# Altium schematic sheet MEA_CLDP.SchDoc
size A1
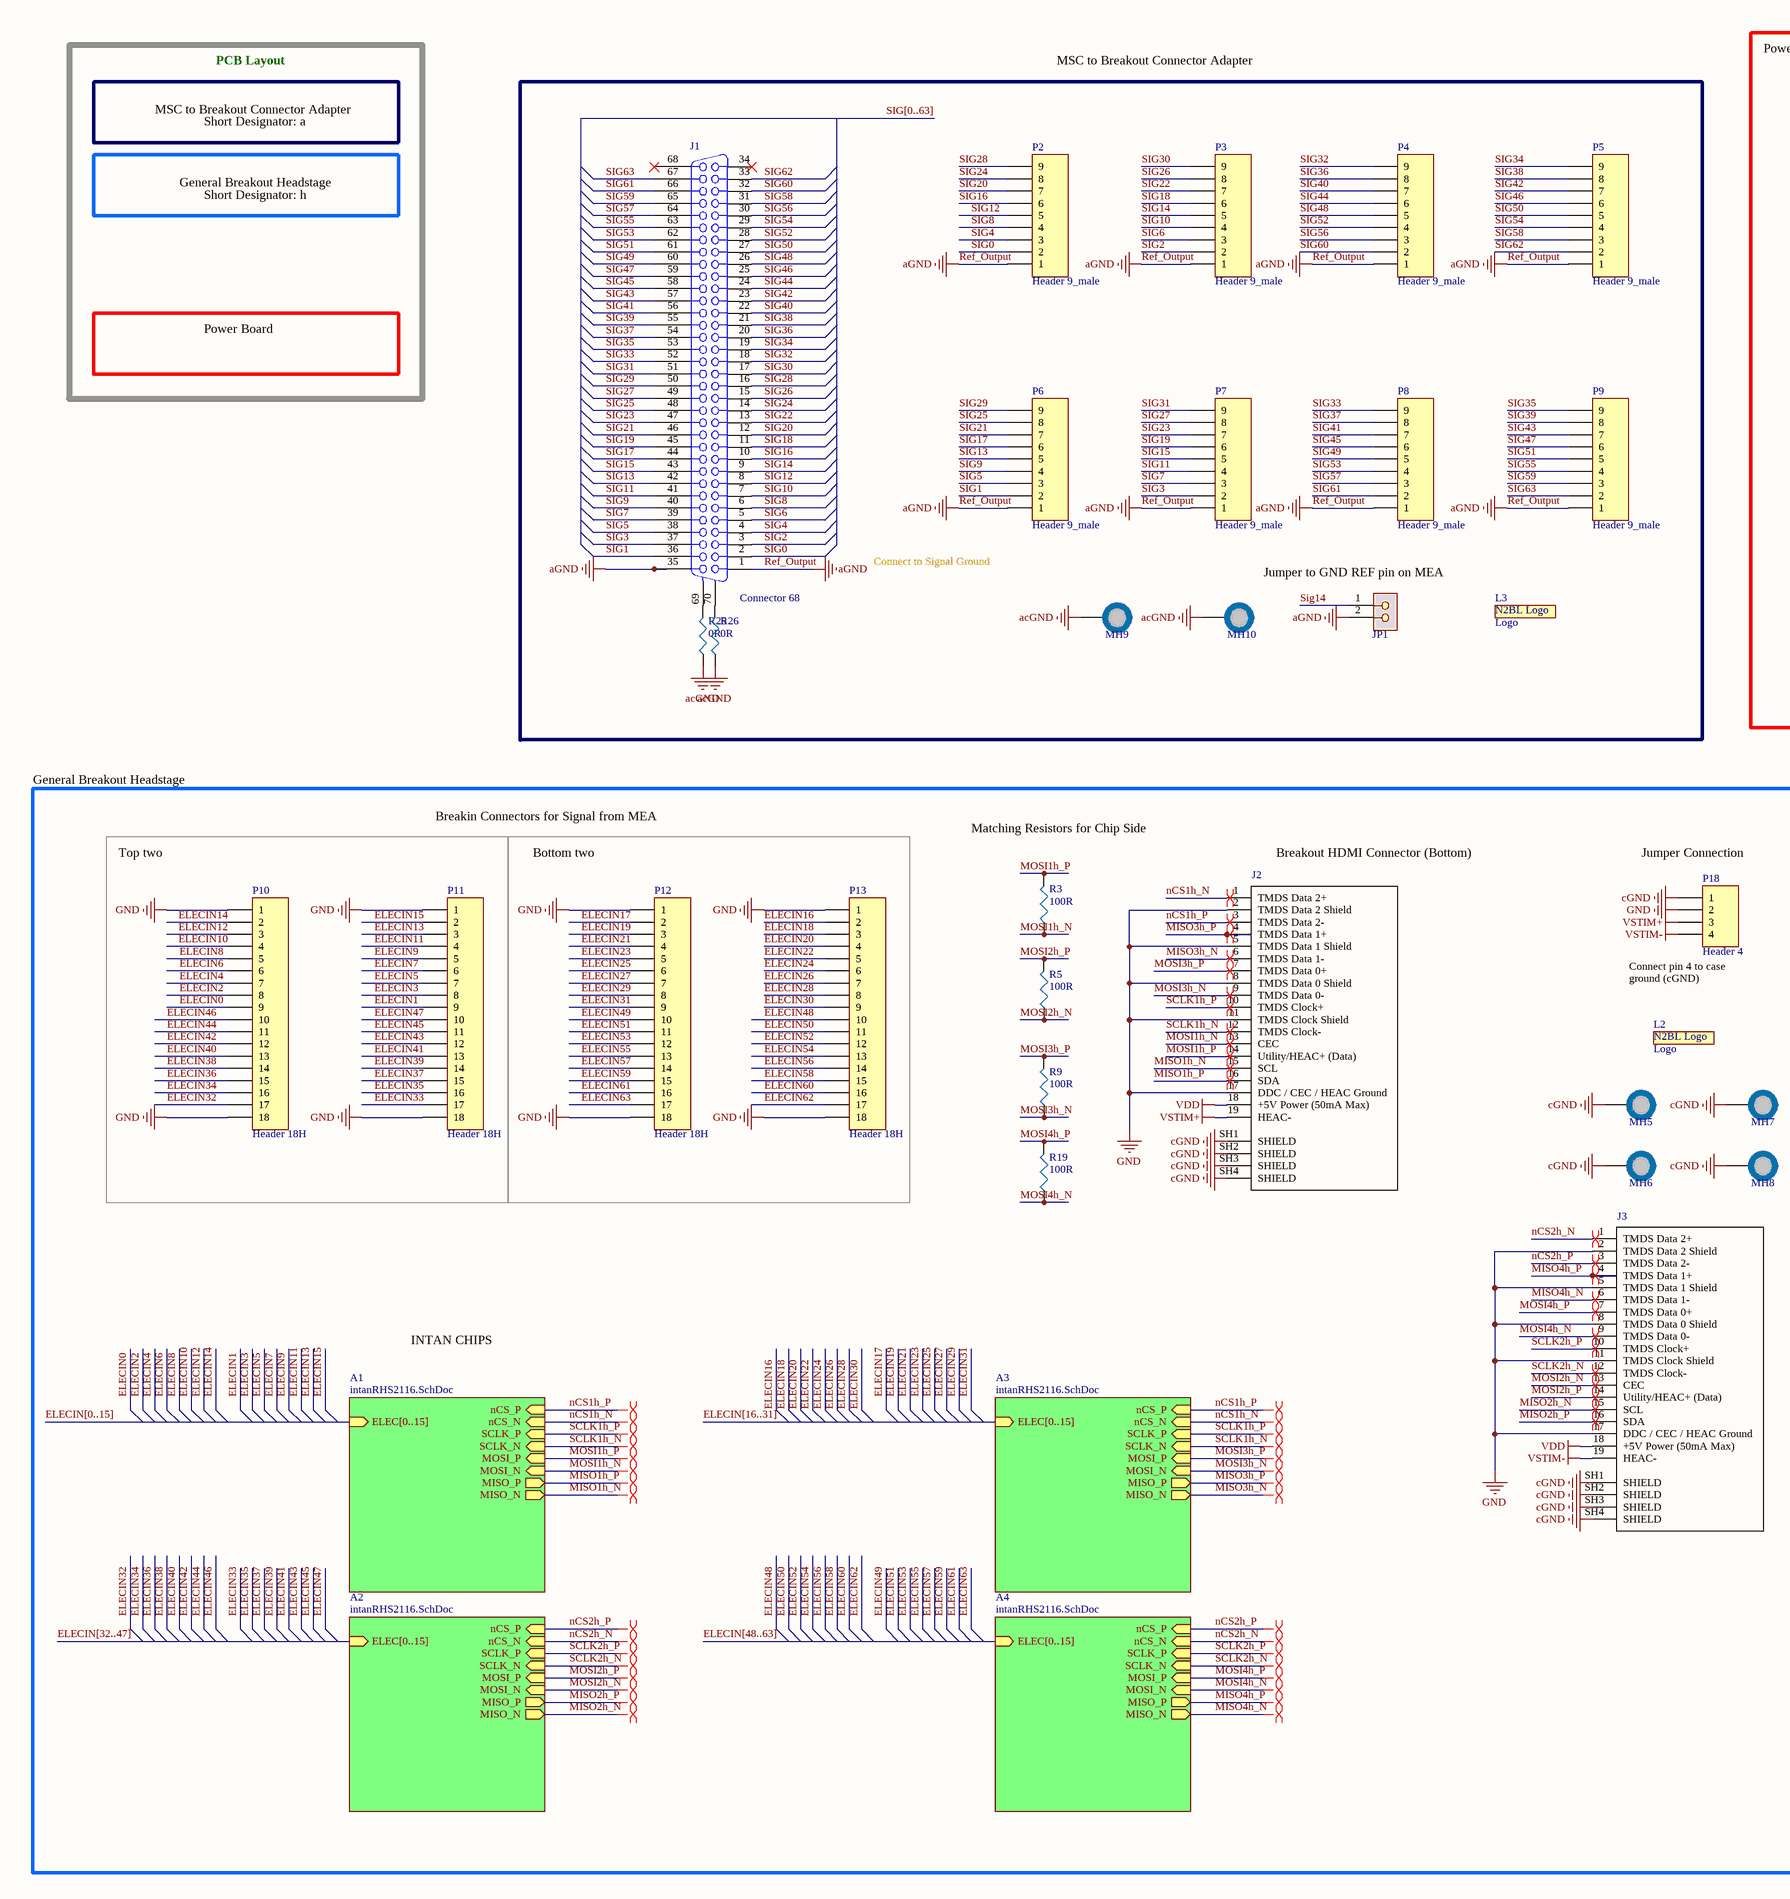
[diagram p0: MEA_CLDP.SchDoc, left]
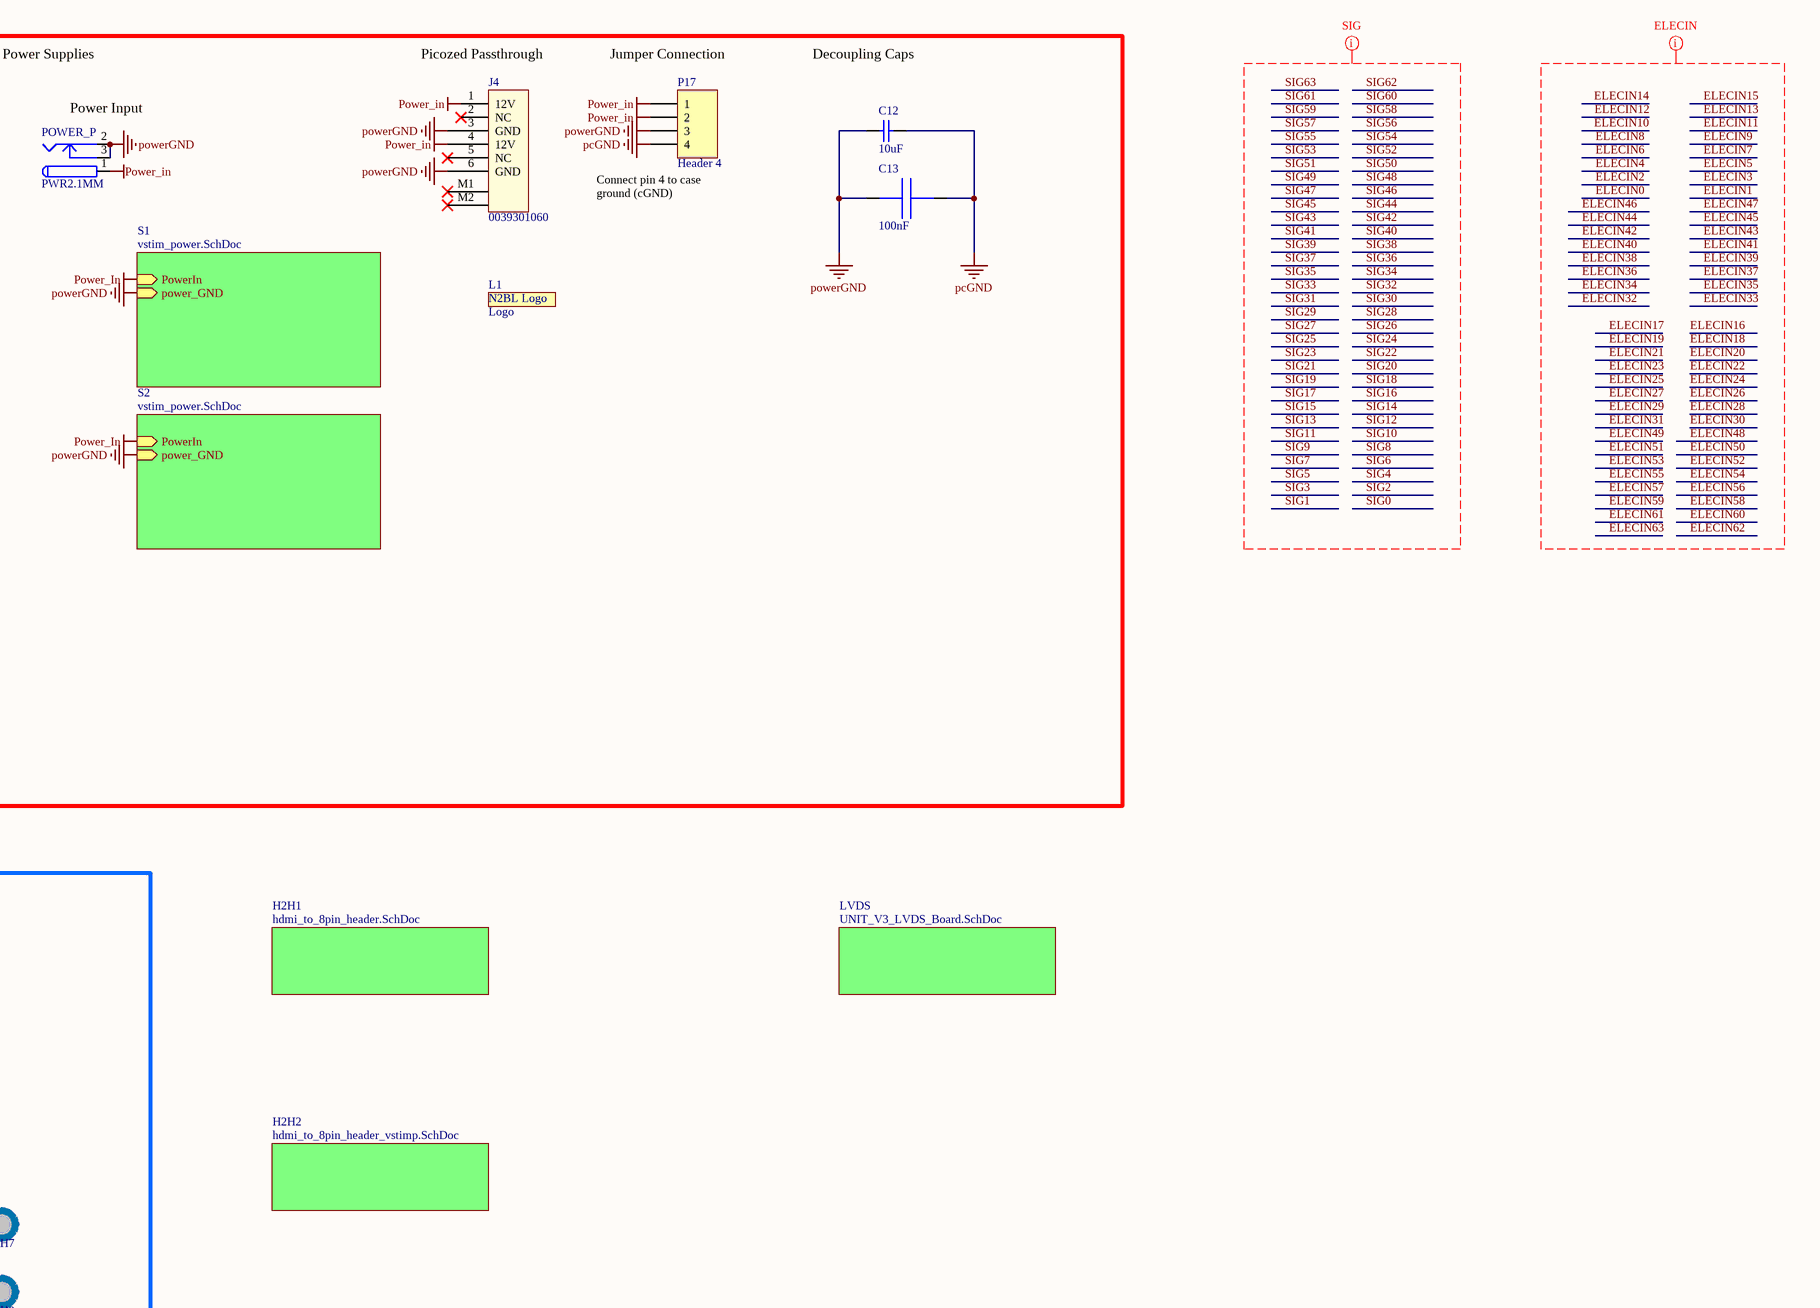
[diagram p1: MEA_CLDP.SchDoc, right]

## Parts
C12  10uF  [C0805]
C13  value 100nF  [rcl_0402i_1005m_most]  (hidden comment: capacitor_npol_ame)
J1  Connector 68  [CONN_2-5174339-5_2-5174339-5(Primary)]
J2  1747981-2  [TE_1747981-2_1747981-2(Primary)]  (value not drawn)
J3  1747981-2  [TE_1747981-2_1747981-2(Primary)]  (value not drawn)
J4  0039301060  [0039301060]
JP1  01x02  [HDR1X2]  (value not drawn)
L1  Logo  [N2BL_LOGO]
L2  Logo  [N2BL_LOGO]
L3  Logo  [N2BL_LOGO]
MH5  MH_7.4MMC_3.2MMD  [MH_7.4MMD_3.2MMD]  (value not drawn)  (no BOM)
MH6  MH_7.4MMC_3.2MMD  [MH_7.4MMD_3.2MMD]  (value not drawn)  (no BOM)
MH7  MH_7.4MMC_3.2MMD  [MH_7.4MMD_3.2MMD]  (value not drawn)  (no BOM)
MH8  MH_7.4MMC_3.2MMD  [MH_7.4MMD_3.2MMD]  (value not drawn)  (no BOM)
MH9  MH_7.4MMC_3.2MMD  [MH_7.4MMD_3.2MMD]  (value not drawn)  (no BOM)
MH10  MH_7.4MMC_3.2MMD  [MH_7.4MMD_3.2MMD]  (value not drawn)  (no BOM)
P2  Header 9_male  [TE_3-644456-9]
P3  Header 9_male  [TE_3-644456-9]
P4  Header 9_male  [TE_3-644456-9]
P5  Header 9_male  [TE_3-644456-9]
P6  Header 9_male  [TE_3-644456-9]
P7  Header 9_male  [TE_3-644456-9]
P8  Header 9_male  [TE_3-644456-9]
P9  Header 9_male  [TE_3-644456-9]
P10  Header 18H  [PPPC181LFBN-RC]
P11  Header 18H  [PPPC181LFBN-RC]
P12  Header 18H  [PPPC181LFBN-RC]
P13  Header 18H  [PPPC181LFBN-RC]
P17  Header 4  [OSTVN04A150]
P18  Header 4  [OSTVN04A150]
POWER_P  PWR2.1MM  [POWER2.1MM]
R3  100R  [rcl_0402i_1005m_most]
R5  100R  [rcl_0402i_1005m_most]
R9  100R  [rcl_0402i_1005m_most]
R19  100R  [rcl_0402i_1005m_most]
R25  0R  [rcl_0402i_1005m_most]
R26  0R  [rcl_0402i_1005m_most]

## Blocks framed on the sheet
Bottom two: P12 P13

## Sub-sheets
A1 = intanRHS2116.SchDoc: ELEC[0..15] (in), nCS_P (in), nCS_N (in), SCLK_P (in), SCLK_N (in), MOSI_P (in), MOSI_N (in), MISO_P (out), MISO_N (out)
A2 = intanRHS2116.SchDoc: ELEC[0..15] (in), nCS_P (in), nCS_N (in), SCLK_P (in), SCLK_N (in), MOSI_P (in), MOSI_N (in), MISO_P (out), MISO_N (out)
A3 = intanRHS2116.SchDoc: ELEC[0..15] (in), nCS_P (in), nCS_N (in), SCLK_P (in), SCLK_N (in), MOSI_P (in), MOSI_N (in), MISO_P (out), MISO_N (out)
A4 = intanRHS2116.SchDoc: ELEC[0..15] (in), nCS_P (in), nCS_N (in), SCLK_P (in), SCLK_N (in), MOSI_P (in), MOSI_N (in), MISO_P (out), MISO_N (out)
H2H1 = hdmi_to_8pin_header.SchDoc: no entries
H2H2 = hdmi_to_8pin_header_vstimp.SchDoc: no entries
LVDS = UNIT_V3_LVDS_Board.SchDoc: no entries
S1 = vstim_power.SchDoc: PowerIn (in), power_GND (in)
S2 = vstim_power.SchDoc: PowerIn (in), power_GND (in)

## Nets
acGND: MH9.1 MH10.1 R25.1 R26.1
cGND: J2.SH1(SHIELD) J2.SH2(SHIELD) J2.SH3(SHIELD) J2.SH4(SHIELD) J3.SH1(SHIELD) J3.SH2(SHIELD) J3.SH3(SHIELD) J3.SH4(SHIELD) MH5.1 MH6.1 MH7.1 MH8.1 P18.1
GND: J2.2(TMDS_Data_2_Shield) J2.5(TMDS_Data_1_Shield) J2.8(TMDS_Data_0_Shield) J2.11(TMDS_Clock_Shield) J2.17(DDC_/_CEC_/_HEAC_Ground) J3.2(TMDS_Data_2_Shield) J3.5(TMDS_Data_1_Shield) J3.8(TMDS_Data_0_Shield) J3.11(TMDS_Clock_Shield) J3.17(DDC_/_CEC_/_HEAC_Ground) P10.1 P10.18 P11.1 P11.18 P12.1 P12.18 P13.1 P13.18 P18.2
pcGND: C12.1 C13.1 P17.4
Power_In: J4.1(12V) J4.4(12V) P17.1 P17.2 POWER_P.1 ; sheet S1/PowerIn, sheet S2/PowerIn
powerGND: C12.2 C13.2 J4.3(GND) J4.6(GND) P17.3 POWER_P.2 POWER_P.3 ; sheet S1/power_GND, sheet S2/power_GND
Ref_Output: J1.1 J1.35 JP1.2 P2.1 P3.1 P4.1 P5.1 P6.1 P7.1 P8.1 P9.1  [also labelled aGND]
VDD: J2.18(+5V_Power_(50mA_Max)) J3.18(+5V_Power_(50mA_Max))
VSTIM+: J2.19(HEAC-) P18.3
VSTIM-: J3.19(HEAC-) P18.4
ELECIN0: P10.9
ELECIN1: P11.9
ELECIN2: P10.8
ELECIN3: P11.8
ELECIN4: P10.7
ELECIN5: P11.7
ELECIN6: P10.6
ELECIN7: P11.6
ELECIN8: P10.5
ELECIN9: P11.5
ELECIN10: P10.4
ELECIN11: P11.4
ELECIN12: P10.3
ELECIN13: P11.3
ELECIN14: P10.2
ELECIN15: P11.2
ELECIN16: P13.2
ELECIN17: P12.2
ELECIN18: P13.3
ELECIN19: P12.3
ELECIN20: P13.4
ELECIN21: P12.4
ELECIN22: P13.5
ELECIN23: P12.5
ELECIN24: P13.6
ELECIN25: P12.6
ELECIN26: P13.7
ELECIN27: P12.7
ELECIN28: P13.8
ELECIN29: P12.8
ELECIN30: P13.9
ELECIN31: P12.9
ELECIN32: P10.17
ELECIN33: P11.17
ELECIN34: P10.16
ELECIN35: P11.16
ELECIN36: P10.15
ELECIN37: P11.15
ELECIN38: P10.14
ELECIN39: P11.14
ELECIN40: P10.13
ELECIN41: P11.13
ELECIN42: P10.12
ELECIN43: P11.12
ELECIN44: P10.11
ELECIN45: P11.11
ELECIN46: P10.10
ELECIN47: P11.10
ELECIN48: P13.10
ELECIN49: P12.10
ELECIN50: P13.11
ELECIN51: P12.11
ELECIN52: P13.12
ELECIN53: P12.12
ELECIN54: P13.13
ELECIN55: P12.13
ELECIN56: P13.14
ELECIN57: P12.14
ELECIN58: P13.15
ELECIN59: P12.15
ELECIN60: P13.16
ELECIN61: P12.16
ELECIN62: P13.17
ELECIN63: P12.17
MISO1h_N: J2.15(SCL) ; sheet A1/MISO_N
MISO1h_P: J2.16(SDA) ; sheet A1/MISO_P
MISO2h_N: J3.15(SCL) ; sheet A2/MISO_N
MISO2h_P: J3.16(SDA) ; sheet A2/MISO_P
MISO3h_N: J2.6(TMDS_Data_1-) ; sheet A3/MISO_N
MISO3h_P: J2.4(TMDS_Data_1+) ; sheet A3/MISO_P
MISO4h_N: J3.6(TMDS_Data_1-) ; sheet A4/MISO_N
MISO4h_P: J3.4(TMDS_Data_1+) ; sheet A4/MISO_P
MOSI1h_N: J2.13(CEC) R3.1 ; sheet A1/MOSI_N
MOSI1h_P: J2.14(Utility/HEAC+_(Data)) R3.2 ; sheet A1/MOSI_P
MOSI2h_N: J3.13(CEC) R5.1 ; sheet A2/MOSI_N
MOSI2h_P: J3.14(Utility/HEAC+_(Data)) R5.2 ; sheet A2/MOSI_P
MOSI3h_N: J2.9(TMDS_Data_0-) R9.1 ; sheet A3/MOSI_N
MOSI3h_P: J2.7(TMDS_Data_0+) R9.2 ; sheet A3/MOSI_P
MOSI4h_N: J3.9(TMDS_Data_0-) R19.1 ; sheet A4/MOSI_N
MOSI4h_P: J3.7(TMDS_Data_0+) R19.2 ; sheet A4/MOSI_P
nCS1h_N: J2.1(TMDS_Data_2+) ; sheet A1/nCS_N, sheet A3/nCS_N
nCS1h_P: J2.3(TMDS_Data_2-) ; sheet A1/nCS_P, sheet A3/nCS_P
nCS2h_N: J3.1(TMDS_Data_2+) ; sheet A2/nCS_N, sheet A4/nCS_N
nCS2h_P: J3.3(TMDS_Data_2-) ; sheet A2/nCS_P, sheet A4/nCS_P
SCLK1h_N: J2.12(TMDS_Clock-) ; sheet A1/SCLK_N, sheet A3/SCLK_N
SCLK1h_P: J2.10(TMDS_Clock+) ; sheet A1/SCLK_P, sheet A3/SCLK_P
SCLK2h_N: J3.12(TMDS_Clock-) ; sheet A2/SCLK_N, sheet A4/SCLK_N
SCLK2h_P: J3.10(TMDS_Clock+) ; sheet A2/SCLK_P, sheet A4/SCLK_P
SIG0: J1.2 P2.2
SIG1: J1.36 P6.2
SIG2: J1.3 P3.2
SIG3: J1.37 P7.2
SIG4: J1.4 P2.3
SIG5: J1.38 P6.3
SIG6: J1.5 P3.3
SIG7: J1.39 P7.3
SIG8: J1.6 P2.4
SIG9: J1.40 P6.4
SIG10: J1.7 P3.4
SIG11: J1.41 P7.4
SIG12: J1.8 P2.5
SIG13: J1.42 P6.5
SIG14: J1.9 JP1.1 P3.5
SIG15: J1.43 P7.5
SIG16: J1.10 P2.6
SIG17: J1.44 P6.6
SIG18: J1.11 P3.6
SIG19: J1.45 P7.6
SIG20: J1.12 P2.7
SIG21: J1.46 P6.7
SIG22: J1.13 P3.7
SIG23: J1.47 P7.7
SIG24: J1.14 P2.8
SIG25: J1.48 P6.8
SIG26: J1.15 P3.8
SIG27: J1.49 P7.8
SIG28: J1.16 P2.9
SIG29: J1.50 P6.9
SIG30: J1.17 P3.9
SIG31: J1.51 P7.9
SIG32: J1.18 P4.9
SIG33: J1.52 P8.9
SIG34: J1.19 P5.9
SIG35: J1.53 P9.9
SIG36: J1.20 P4.8
SIG37: J1.54 P8.8
SIG38: J1.21 P5.8
SIG39: J1.55 P9.8
SIG40: J1.22 P4.7
SIG41: J1.56 P8.7
SIG42: J1.23 P5.7
SIG43: J1.57 P9.7
SIG44: J1.24 P4.6
SIG45: J1.58 P8.6
SIG46: J1.25 P5.6
SIG47: J1.59 P9.6
SIG48: J1.26 P4.5
SIG49: J1.60 P8.5
SIG50: J1.27 P5.5
SIG51: J1.61 P9.5
SIG52: J1.28 P4.4
SIG53: J1.62 P8.4
SIG54: J1.29 P5.4
SIG55: J1.63 P9.4
SIG56: J1.30 P4.3
SIG57: J1.64 P8.3
SIG58: J1.31 P5.3
SIG59: J1.65 P9.3
SIG60: J1.32 P4.2
SIG61: J1.66 P8.2
SIG62: J1.33 P5.2
SIG63: J1.67 P9.2
NetJ1_69: J1.69(MH1) R25.2
NetJ1_70: J1.70(MH2) R26.2

Not connected (* = marked no-connect by the designer): J1 34* 68*; J4 2(NC)* 5(NC)* M1* M2*

## Buses and harness runs
bus ELECIN[0..15] = sheet A1/ELEC[0..15]
bus ELECIN[16..31] = sheet A3/ELEC[0..15]
bus ELECIN[32..47] = sheet A2/ELEC[0..15]
bus ELECIN[48..63] = sheet A4/ELEC[0..15]
bus SIG[0..63]

## Layout directives
differential pair: MISO1h_N, MISO1h_P, MISO2h_N, MISO2h_P, MISO3h_N, MISO3h_P, MISO4h_N, MISO4h_P, MOSI1h_N, MOSI1h_P, MOSI2h_N, MOSI2h_P, MOSI3h_N, MOSI3h_P, MOSI4h_N, MOSI4h_P, nCS1h_N, nCS1h_P, nCS2h_N, nCS2h_P, SCLK1h_N, SCLK1h_P, SCLK2h_N, SCLK2h_P
net class SIG_ALL: SIG0, SIG1, SIG2, SIG3, SIG4, SIG5, SIG6, SIG7, SIG8, SIG9, SIG10, SIG11, SIG12, SIG13, SIG14, SIG15, SIG16, SIG17, SIG18, SIG19, SIG20, SIG21, SIG22, SIG23, SIG24, SIG25, SIG26, SIG27, SIG28, SIG29, SIG30, SIG31, SIG32, SIG33, SIG34, SIG35, SIG36, SIG37, SIG38, SIG39, SIG40, SIG41, SIG42, SIG43, SIG44, SIG45, SIG46, SIG47, SIG48, SIG49, SIG50, SIG51, SIG52, SIG53, SIG54, SIG55, SIG56, SIG57, SIG58, SIG59, SIG60, SIG61, SIG62, SIG63
net class ELECIN_ALL: ELECIN0, ELECIN1, ELECIN2, ELECIN3, ELECIN4, ELECIN5, ELECIN6, ELECIN7, ELECIN8, ELECIN9, ELECIN10, ELECIN11, ELECIN12, ELECIN13, ELECIN14, ELECIN15, ELECIN16, ELECIN17, ELECIN18, ELECIN19, ELECIN20, ELECIN21, ELECIN22, ELECIN23, ELECIN24, ELECIN25, ELECIN26, ELECIN27, ELECIN28, ELECIN29, ELECIN30, ELECIN31, ELECIN32, ELECIN33, ELECIN34, ELECIN35, ELECIN36, ELECIN37, ELECIN38, ELECIN39, ELECIN40, ELECIN41, ELECIN42, ELECIN43, ELECIN44, ELECIN45, ELECIN46, ELECIN47, ELECIN48, ELECIN49, ELECIN50, ELECIN51, ELECIN52, ELECIN53, ELECIN54, ELECIN55, ELECIN56, ELECIN57, ELECIN58, ELECIN59, ELECIN60, ELECIN61, ELECIN62, ELECIN63

## Notes on the sheet
- PCB Layout
- MSC to Breakout Connector Adapter
- Power Supplies
- (near J4) Picozed Passthrough
- (near P17) Jumper Connection
- Decoupling Caps
- Short Designator: a
- (near POWER_P) Power Input
- General Breakout Headstage
- Short Designator: h
- (near P17) Connect pin 4 to case ground (cGND)
- Power Board
- Connect to Signal Ground
- (near JP1) Jumper to GND REF pin on MEA
- Breakin Connectors for Signal from MEA
- Top two
- Matching Resistors for Chip Side
- (near J2) Breakout HDMI Connector (Bottom)
- (near P18) Jumper Connection
- (near P18) Connect pin 4 to case ground (cGND)
- INTAN CHIPS
- (in symbol Neuron To Brain Lab Logo) N2BL Logo

## Library data of the parts
C12 = C2012X5R1E106K085AC: CAP 10UF; Manufacturer: Samsung Electro-Mechanics; Manufacturer Part Number: CL21A106KAYNNNE; Dielectric Material: Ceramic; Tolerance: 10%; Voltage Rating: 25V; Dielectric: X5R; Supplier 1: Digi-Key; Stock 1: 843; Pricing 1: 1=0.39;  10=0.264;  100=0.13340;  500=0.09128;  1000=0.08075  (CAD); Mount: Surface Mount; Case/Package: 0805; Case Code (Metric): 2012; Case Code (Imperial): 0805; Min Operating Temperature: -55°C; Max Operating Temperature: 85°C; Packaging: Tape and Reel; Capacitance: 10uF; Termination: SMD/SMT; Voltage Rating (DC): 25V; Length: 0.079inch; Width: 0.049inch; Thickness: 1.25mm; Lead Free: Lead Free; ComponentLink1URL: http://www.samsungsem.com/kr/support/product-search/mlcc/__icsFiles/afieldfile/2018/06/20/CL21A106KAYNNNE.pdf; ComponentLink1Description: Specifications; ComponentLink2URL: https://media.digikey.com/pdf/Data%20Sheets/Samsung%20PDFs/CL21A106KAYNNNE_Char.pdf; ComponentLink2Description: Characteristics; ComponentLink3URL: https://media.digikey.com/pdf/Data%20Sheets/Samsung%20PDFs/CL_Series_MLCC_ds.pdf; ComponentLink3Description: Datasheet; Supplier Part Number 1: 1276-2891-1-ND; Supplier Link 1: https://www.digikey.ca/product-detail/en/samsung-electro-mechanics/CL21A106KAYNNNE/1276-2891-1-ND/3890977
C13 = capacitor_npol_ame: Capacitor Non-polarized American Symbol; Manufacturer: Yageo; Manuracturer Part Number: CC0402KRX7R8BB104; Voltage Rating: 25V; Priging 1: 1 	0.15000 	$0.15 (CAD); Package: 0402; Supplier 1: Digikey; Supplier Part Number 1: 311-2077-1-ND; Supplier Link 1: https://www.digikey.ca/product-detail/en/yageo/CC0402KRX7R8BB104/311-2077-1-ND/5698948; Stock 1: 143,749; ComponentLink1URL: http://www.yageo.com/documents/recent/UPY-GPHC_X7R_6.3V-to-50V_18.pdf; ComponentLink1Description: Datasheet; Supplier Description 1: CAP CER 0.1UF 25V X7R 0402
J1 = Connector 68: Receptacle Header Assemby; Manufacturer: TE Connectivity; Manufacturer Part Number: 2-5174339-5; Pricing1: 1=29.61;  10=26.727;  25=25.60760;  50=24.007  (CAD); Supplier 1: Digi-Key; ComponentLink1Description: Datasheet; ComponentLink1URL: https://www.te.com/commerce/DocumentDelivery/DDEController?Action=srchrtrv&DocNm=5174339&DocType=Customer+Drawing&DocLang=English; Stock1: 1335; Supplier Link 1: https://www.digikey.ca/product-detail/en/te-connectivity-amp-connectors/2-5174339-5/A121355-ND/1835651; Manufacturer Link: https://www.te.com/usa-en/product-2-5174339-5.html#pdp-docs-features; Supplier Part Number 1: A121355-ND
J2 J3 = 1747981-2: Conn HDMI RCP 19 POS 0.5mm Solder ST SMD 19 Terminal 1 Port T/R; MF: TE Connectivity; Detailed Description: HDMI Receptacle Connector 19 Position Panel Mount; Surface Mount, Right Angle; Through Hole; Pricing1: 1  6.31000  $6.31  10  6.04800  $60.48  25  5.54400  $138.60  50  5.29240  $264.62  100  5.04030  $504.03 (CAD); TE_purchase_URL: https://www.te.com/usa-en/product-1747981-2.html?te_bu=Cor&te_type=disp&te_campaign=seda_glo_cor-seda-global-disp-prtnr-fy19-seda-model-bom-cta_sma-317_1&elqCampaignId=32493; SnapEDA_Link: https://www.snapeda.com/parts/1747981-2/TE%20Connectivity%20AMP%20Connectors/view-part/?ref=snap; Package: None; MP: 1747981-2; EU_RoHS_Compliance: Compliant; Availability: Unavailable; Price: None; Value: *; ComponentLink1Description: Datasheet; ComponentLink1URL: https://www.te.com/commerce/DocumentDelivery/DDEController?Action=srchrtrv&DocNm=1747981&DocType=Customer+Drawing&DocLang=English; Manufacturer: TE Connectivity; Manufacturer Part Number: 1747981-2; Stock1: 1,426; Supplier 1: Digikey; Supplier Link 1: https://www.digikey.ca/product-detail/en/te-connectivity-amp-connectors/1747981-2/A130924CT-ND/8602669; Supplier Part Number 1: A130924CT-ND
J4 = 0039301060: CONN HEADER R/A 6POS 4.2MM; Manufacturer: Molex; Pricing1: 1  1.41000  $1.41  10  1.25000  $12.50  100  1.07790  $107.79  500  0.88194  $440.97  1,000  0.78394  $783.94  5,000  0.68595  $3,429.73  10,000  0.65165  $6,516.48 (CAD); Manufacturer Part Number: 0039301060; Supplier Link 1: https://www.digikey.ca/product-detail/en/molex/0039301060/WM1353-ND/561080; Supplier 1: Digikey; Supplier Part Number 1: WM1353-ND; Stock1: 8,844; ComponentLink1URL: https://www.molex.com/pdm_docs/sd/039301060_sd.pdf; ComponentLink1Description: Datasheet
JP1 = 01x02: 01X02 generic terminal connector
L1-L3 = Neuron To Brain Lab Logo
MH5-MH10 = MH_7.4MMC_3.2MMC: Mounting Hole 7.4mm Diameter, 3.2mm Drill
P2-P9 = Header 9_male: Header, 9-Pin; Manufacturer: TE Connectivity AMP Connectors; Manufacturer Part Number: 3-644456-9; Manufacturer Link: https://www.te.com/global-en/product-3-644456-9.html; Supplier 1: Digikey; Supplier Link 1: https://www.digikey.ca/product-detail/en/te-connectivity-amp-connectors/3-644456-9/A31119-ND/698351; Supplier Part Number 1: A31119-ND; Stock1: 6,446; Price1: 1=0.81000;  10=0.76300;  100=0.58520;  500=0.50888;  1,000=0.41984;  5,000=0.36894;  10,000=0.34350 (CAD); ComponentLink1URL: https://www.te.com/commerce/DocumentDelivery/DDEController?Action=srchrtrv&DocNm=644456&DocType=Customer+Drawing&DocLang=English; ComponentLink1Description: Datasheet
P10-P13 = Header 18H: CONN RCPT 18POS 0.1 GOLD PCB; Manufacturer: Sullins Connector Solutions; Pricing1: 1 	1.63000 	$1.63; Publisher: Altium Limited; Manufacturer Part Number: PPPC181LFBN-RC; Supplier 1: Digikey; Supplier Part Number 1: S7051-ND; ComponentLink1URL: https://drawings-pdf.s3.amazonaws.com/10492.pdf; ComponentLink2URL: https://media.digikey.com/pdf/Data%20Sheets/Sullins%20PDFs/Female_Headers.100_DS.pdf; ComponentLink1Description: Datasheet Drawing; ComponentLink2Description: Datasheet General Headers; Stock1: 1,744; Supplier Link 1: https://www.digikey.ca/product-detail/en/sullins-connector-solutions/PPPC181LFBN-RC/S7051-ND/810190; Manufacturer Link 1: https://www.sullinscorp.com/product/?pn=PPPC181LFBN-RC&toggle=in
P17 P18 = Header 4: Header, 4-Pin; Manufacturer: On Shore Technology Inc.; Detailed Description: 4 Position Wire to Board Terminal Block Horizontal with Board 0.100" (2.54mm) Through Hole; Pitch (Imperial): 100mil; LatestRevisionDate: 17-Jul-2002; LatestRevisionNote: Re-released for DXP Platform.; Publisher: Altium Limited; Manufacturer Part Number: OSTVN04A150; Manufacturer Link: https://www.on-shore.com/part/ostvnxxa150-terminal-block-one-piece-rising-clamp/; Supplier 1: Digikey; Supplier Link 1: https://www.digikey.com/product-detail/en/on-shore-technology-inc/OSTVN04A150/ED10563-ND/1588864; Supplier Part Number 1: ED10563-ND; Pricing 1: 1  1.38000  $1.38  10  0.96900  $9.69  25  0.90400  $22.60  50  0.82040  $41.02  100  0.81680  $81.68  250  0.68972  $172.43  500  0.65340  $326.70  1,000  0.58080  $580.80  5,000  0.47190  $2,359.50 (CAD); Stock 1: 8,195; ComponentLink1URL: http://www.on-shore.com/wp-content/uploads/OSTVNXXA150.pdf; ComponentLink1Description: Datasheet
POWER_P = PWR2.1MM: PJ-002AH; Manufacturer: CUI; Gender: Male; Shielding: Unshielded; Connector Type: Jack; Current Rating: 5A; Number of Conductors: 2; Voltage Rating: 24V; Insulation Resistance: 50MR; Supplier 1: Digi-Key; Manufacturer Part Number: PJ-002AH; Stock 1: 95768; Pricing 1: 1=0.74, 10=0.696, 25=0.6264, 50=0.5568, 100=0.5336, 250=0.4872, 500=0.464, 1000=0.3828, 2500=0.348 (USD); Mount: Through Hole; Colour: Black; Contact Material: Copper,Copper Alloy; Contact Plating: Nickel; Housing Material: Thermoplastic; Housing Colour: Black; Min Operating Temperature: -25°C; Max Operating Temperature: 85°C; Packaging: Bulk; Termination: Through Hole; Orientation: Horizontal; Package Quantity: 500; Contact Gender: Male; Diameter: 2.1mm; Lead Free: Lead Free; Flammability Rating: UL94 V-0; ComponentLink1URL: http://www.cui.com/Product/Resource/FuturePDF/PJ-002AH.pdf; ComponentLink1Description: http://www.cui.com/Product/Resource/FuturePDF/PJ-002AH.pdf; ComponentLink2URL: http://www.cui.com/product/resource/digikeypdf/pj-002ah.pdf; ComponentLink2Description: http://www.cui.com/product/resource/digikeypdf/pj-002ah.pdf; ComponentLink3URL: http://www.mouser.com/ds/2/670/pj-002ah-516007.pdf; ComponentLink3Description: http://www.mouser.com/ds/2/670/pj-002ah-516007.pdf; Supplier Part Number 1: CP-002AH-ND; Supplier Link 1: https://www.digikey.ca/products/en?keywords=CP-002AH-ND
R3 R5 R9 R19 = RES100: RES SMD 100 OHM 1% 1/16W 0402; Manufacturer: Vishay Dale; Manufacturer Part Number: CRCW0402100RFKED; Temperature Coefficient: 100ppm/°C; Power Rating: 0.063W; Voltage Rating: 50V; Assembly Note: If Vishay Dale part not in stock as free passive part, use Panasonic resistor instead; Tolorance 2: 0.5%; Supplier 1: 7PCB/Bittle; Stock 1: 0; Pricing 1: Free; Case/Package: 0402; Case Code (Metric): 1005; Case Code (Imperial): 0402; Min Operating Temperature: -55°C; Max Operating Temperature: 155°C; Tolerance 1: 1%; Resistance: 100R; Packaging: Paper Tape; Composition: Thick Film; Package Quantity: 1; Number of Terminations: 2; Termination: SMD/SMT; Military Standard: Not; Max Power Dissipation: 0.063W; REACH SVHC: Unknown; Lead Free: Lead Free; ComponentLink1URL: http://www.vishay.com/docs/20035/dcrcwe3.pdf; ComponentLink1Description: Datasheet 1; Supplier Part Number 1: CRCW0402100RFKED; Weight: 4mg; Length: 1mm; Width: 0.5mm; Supplier Link 1: https://parts.7pcb.com/; Supplier Description 1: RES SMD 100 OHM 1% 1/16W 0402; Height: 0.4mm; Manufacturer 2: Panasonic Electronic Components; Manufacturer Part Number 2: ERA-2AED101X; ComponentLink2URL: https://industrial.panasonic.com/cdbs/www-data/pdf/RDM0000/AOA0000C307.pdf; ComponentLink2Description: Datasheet 2; Supplier 2: Digi-Key; Supplier Part Number 2: P100DECT-ND; Supplier Description 2: 100 Ohms ±0.5% 0.063W, 1/16W Chip Resistor 0402 (1005 Metric) Automotive AEC-Q200 Thin Film; Pricing 2: 1  0.34000  $0.34  10  0.29100  $2.91  100  0.11370  $11.37  1,000  0.04762  $47.62  2,500  0.04364  $109.11  5,000  0.03968  $198.40
R25 R26 = RES100: RES SMD 0 OHM JUMPER 1/16W 0402; Manufacturer: Vishay Dale; Manufacturer Part Number: CRCW04020000Z0ED; Tolerance 1: 1%; Resistance: 100R; Temperature Coefficient: 100ppm/°C; Power Rating: 0.063W; Voltage Rating: 50V; Tolorance 2: 0.5%; Supplier 1: 7PCB/Bittle; Stock 1: 1271266; Pricing 1: Free; Case/Package: 0402; Case Code (Metric): 1005; Case Code (Imperial): 0402; Min Operating Temperature: -55°C; Max Operating Temperature: 155°C; Packaging: Paper Tape; Composition: Thick Film; Package Quantity: 1; Number of Terminations: 2; Termination: SMD/SMT; Military Standard: Not; Max Power Dissipation: 0.063W; REACH SVHC: Unknown; Lead Free: Lead Free; ComponentLink1URL: http://www.vishay.com/docs/20035/dcrcwe3.pdf; ComponentLink1Description: Datasheet 1; Supplier Part Number 1: CRCW04020000Z0ED; Length: 1mm; Width: 0.5mm; Supplier Link 1: https://parts.7pcb.com/; Supplier Description 1: RES SMD 0.0OHM JUMPER 1/16W 0402; Height: 0.4mm